# Altium schematic sheet Tiny817_Xplained_Pro_current_measurement.SchDoc: Current measurement
size A3; Organization: ATMEL Norway; Address1: Vestre Rosten 79; Address2: N-7075 TILLER; Address3: NORWAY; DocumentNumber: A09-2654; Revision: 4; SheetNumber: 5; SheetTotal: 9; PageSetup: Record=PageOptions|CenterHorizontal=True|CenterVertical=True|PrintScale=1.01|XCorrection=1.00|YCorrection=1.00|PrintKind=1|BorderSize=5000000|LeftOffset=0|BottomOffset=0|Orientation=2|PaperLength=1000|PaperWidth=1000|Scale=100|PaperSource=7|PrintQuality=-4|MediaType=1|DitherType=10|PaperKind=A3 (297 x 420 mm)|PrintScaleMode=1
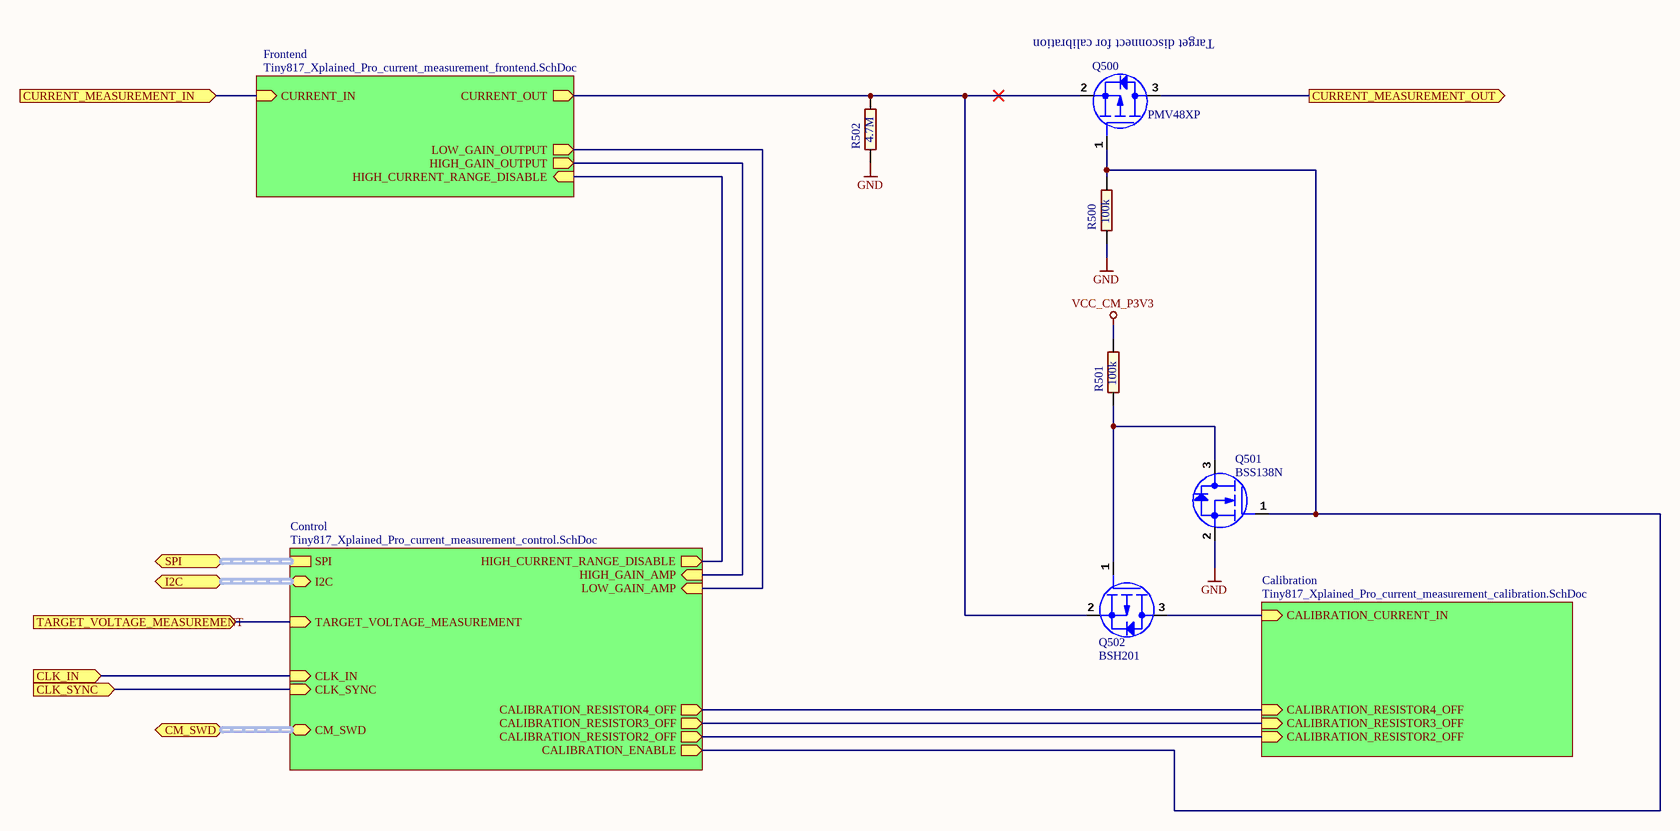
[diagram p0: Tiny817_Xplained_Pro_current_measurement.SchDoc]

## Parts
Q500  value PMV48XP  [AP5-00002]
Q501  value BSS138N  [AP5-00002]
Q502  value BSH201  [AP5-00002]
R500  value 100k  [AP2-00011]
R501  value 100k  [AP2-00011]
R502  value 4.7M  [AP2-00011]

## Sub-sheets
Calibration = Tiny817_Xplained_Pro_current_measurement_calibration.SchDoc: CALIBRATION_RESISTOR2_OFF (in), CALIBRATION_RESISTOR3_OFF (in), CALIBRATION_RESISTOR4_OFF (in), CALIBRATION_CURRENT_IN (in)
Control = Tiny817_Xplained_Pro_current_measurement_control.SchDoc: LOW_GAIN_AMP (in), HIGH_GAIN_AMP (in), HIGH_CURRENT_RANGE_DISABLE (out), SPI (harness SPI), CALIBRATION_RESISTOR3_OFF (out), CALIBRATION_RESISTOR2_OFF (out), CALIBRATION_ENABLE (out), CALIBRATION_RESISTOR4_OFF (out), I2C (harness I2C), CLK_IN (in), CLK_SYNC (in), TARGET_VOLTAGE_MEASUREMENT (in), CM_SWD (harness SWD)
Frontend = Tiny817_Xplained_Pro_current_measurement_frontend.SchDoc: CURRENT_OUT (out), CURRENT_IN (in), LOW_GAIN_OUTPUT (out), HIGH_GAIN_OUTPUT (out), HIGH_CURRENT_RANGE_DISABLE (in)

## Ports
CLK_IN (in), CLK_SYNC (in), CM_SWD (harness SWD), CURRENT_MEASUREMENT_IN (in), CURRENT_MEASUREMENT_OUT (out), I2C (harness I2C), SPI (harness SPI), TARGET_VOLTAGE_MEASUREMENT (in)

## Nets
GND: Q501.2(S) R500.1 R502.1
VCC_CM_P3V3: R501.2
CLK_IN: port CLK_IN, sheet Control/CLK_IN
CLK_SYNC: port CLK_SYNC, sheet Control/CLK_SYNC
CURRENT_MEASUREMENT_IN: port CURRENT_MEASUREMENT_IN, sheet Frontend/CURRENT_IN
CURRENT_MEASUREMENT_OUT: Q500.3(D) ; port CURRENT_MEASUREMENT_OUT
TARGET_VOLTAGE_MEASUREMENT: port TARGET_VOLTAGE_MEASUREMENT, sheet Control/TARGET_VOLTAGE_MEASUREMENT
NetQ500_1: Q500.1(G) Q501.1(G) R500.2 ; sheet Control/CALIBRATION_ENABLE
NetQ500_2: Q500.2(S) Q502.2(S) R502.2 ; sheet Frontend/CURRENT_OUT
NetQ501_3: Q501.3(D) Q502.1(G) R501.1
NetQ502_3: Q502.3(D) ; sheet Calibration/CALIBRATION_CURRENT_IN
(unnamed): sheet Calibration/CALIBRATION_RESISTOR2_OFF, sheet Control/CALIBRATION_RESISTOR2_OFF
(unnamed): sheet Calibration/CALIBRATION_RESISTOR3_OFF, sheet Control/CALIBRATION_RESISTOR3_OFF
(unnamed): sheet Calibration/CALIBRATION_RESISTOR4_OFF, sheet Control/CALIBRATION_RESISTOR4_OFF
(unnamed): sheet Control/LOW_GAIN_AMP, sheet Frontend/LOW_GAIN_OUTPUT
(unnamed): sheet Control/HIGH_GAIN_AMP, sheet Frontend/HIGH_GAIN_OUTPUT
(unnamed): sheet Control/HIGH_CURRENT_RANGE_DISABLE, sheet Frontend/HIGH_CURRENT_RANGE_DISABLE

## Buses and harness runs
harness port CM_SWD = sheet Control/CM_SWD
harness port I2C = sheet Control/I2C
harness port SPI = sheet Control/SPI

## Notes on the sheet
- (near Q500) Target disconnect for calibration
- Date:
- PAGE:
- of
- TITLE:
- Document number:
- Revision:

## Library data of the parts
Q500 = A05-0130: P-Channel Digital FET. -30V, -3.5A continuous, -14A Peak. RDS(ON)=48mOhm@VGS=-4.5V, RDS(ON)=71mOhm@VGS=-2.5V. VGS(th)<1.25V; PartGroup: Transistors,Power FET,SMD; Manufacturer: NXP; MPN: PMV48XP,215; TemperatureRange: -55Â°C to +150Â°C; AN: A05-0130
Q501 = A05-0140: Low leakage N-Channel MOSFET. 60V, 0.23A continuous, 0.92A Peak. RDS(ON) = 3.5Ohm@VGS=4.5V, VGS(th)<1.4V; PartGroup: Transistors,Small signal FET,SMD; Manufacturer: Infineon; TemperatureRange: -55  to +150 deg celcius; AN: A05-0140; Height: 1,10000002384186; MPN: BSS138N
Q502 = A05-0132: P-Channel Digital FET. -60V, -0.3A continuous, -1.2A Peak. RDS(ON)=2.5@VGS=-10V, RDS(ON)=<5 ohm @VGS=-2.5V. VGS(th)<1.9V; PartGroup: Transistors,Small signal FET,SMD; Manufacturer: NXP; MPN: BSH201,215; AN: A05-0132
R500 R501 = A02-0260: Thick film resistor, SMD 0402, 1/16W, 1%; PartGroup: Resistors,SMD,0402 1%; Manufacturer: ASJ; MPN: CR10-1003-FK; TemperatureRange: -55ï¿½ to +125ï¿½C; AN: A02-0260; Tolerance: 1 %; Height: 0,349999994039536
R502 = A02-0884: Thick film SMD 0402 1/16W 1%; PartGroup: Resistors,SMD,0402 1%; Manufacturer: YAGEO CORP; MPN: RC0402FR-074M7L; TemperatureRange: -55 Â°C to +155 Â°C; AN: A02-0884; Tolerance: 1 %